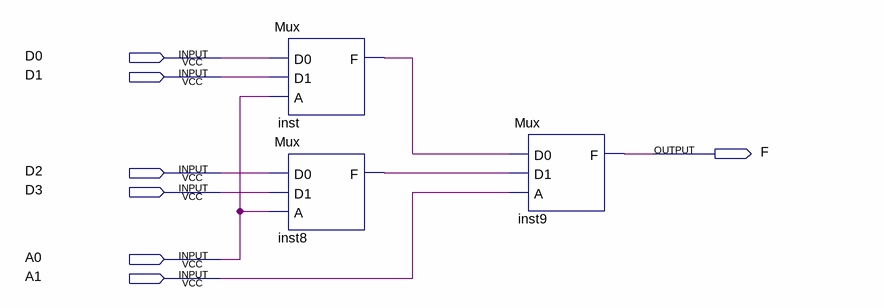
[diagram p0: schematic sheet]
// Quartus schematic Mux4Way.bdf as structural Verilog: 3 symbols, 7 pins
module Mux4Way (
  input  D0,
  input  D1,
  input  D2,
  input  D3,
  input  A0,
  input  A1,
  output F
);

  wire inst8_f, inst_f;

  Mux inst (.D0(D0), .D1(D1), .A(A0), .F(inst_f));
  Mux inst8 (.D0(D2), .D1(D3), .A(A0), .F(inst8_f));
  Mux inst9 (.D0(inst_f), .D1(inst8_f), .A(A1), .F(F));
endmodule
